# Altium schematic sheet TEMPLATE_Circuit.SchDoc
size Tabloid; Date: Date; Author: Author 1; Revision: 1; SheetNumber: 3; SheetTotal: 4; Size: 11x17; Sheet_Name: Circuit
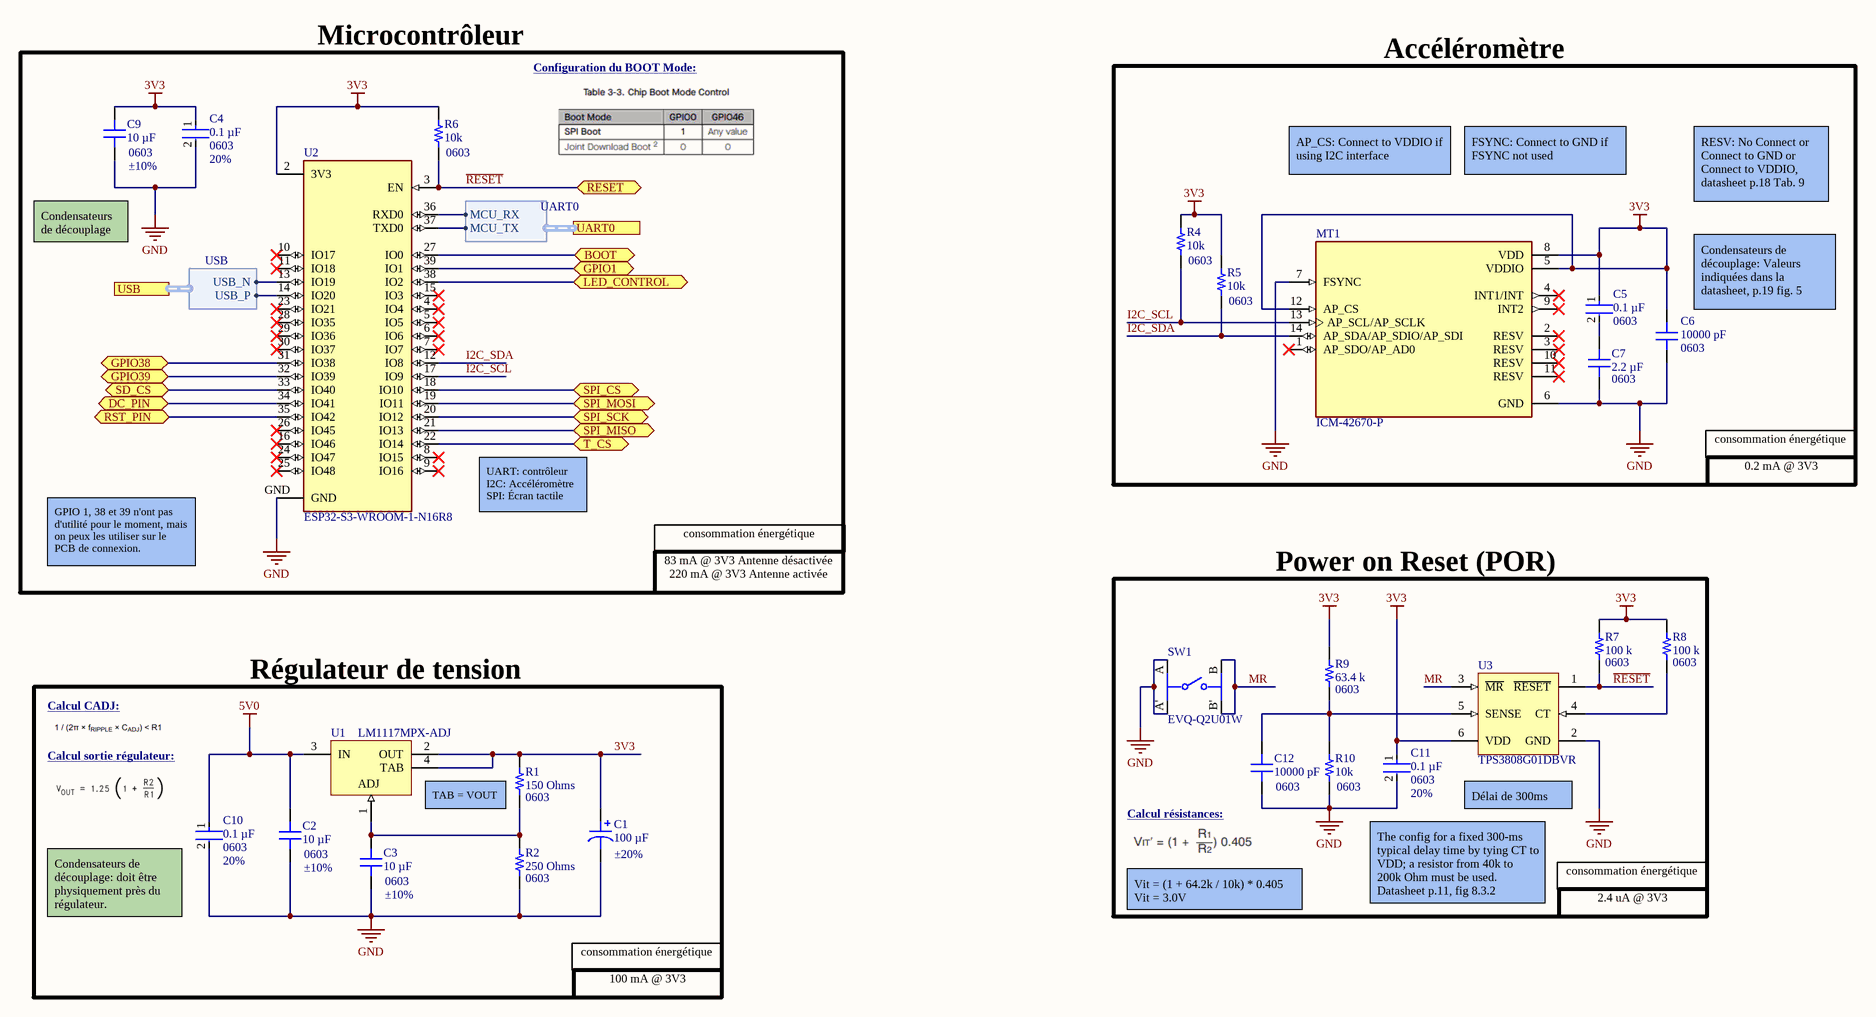
[diagram p0: TEMPLATE_Circuit.SchDoc]

## Parts
C1  100 µF  Tolerance: ±20%  [CAP ALSMD 6.6MM H6.1MM]
C2  Device Package: 0603  Tolerance: ±10%  [CAP 0603_1608]  (hidden comment: 10 µF)
C3  Device Package: 0603  Tolerance: ±10%  [CAP 0603_1608]  (hidden comment: 10 µF)
C4  Case Code (Imperial): 0603  Tolerance: 20%  Capacitance: 0.1 µF  [FP-0603-L_1_6_0_15-W_0_81-IPC_B]  (hidden comment: 0603ZC104MAT2A)
C5  Case Code (Imperial): 0603  Capacitance: 0.1 µF  [FP-0603-L_1_6_0_15-W_0_81-IPC_B]  (hidden comment: 0603ZC104MAT2A)
C6  Package / Case: 0603  [CAP 0603_1608]  (hidden comment: 10000 pF)
C7  Package / Case: 0603  [MURATA GRM188 0603_1608]  (hidden comment: 2.2 µF)
C9  Device Package: 0603  Tolerance: ±10%  [CAP 0603_1608]  (hidden comment: 10 µF)
C10  Case Code (Imperial): 0603  Tolerance: 20%  Capacitance: 0.1 µF  [FP-0603-L_1_6_0_15-W_0_81-IPC_B]  (hidden comment: 0603ZC104MAT2A)
C11  Case Code (Imperial): 0603  Tolerance: 20%  Capacitance: 0.1 µF  [FP-0603-L_1_6_0_15-W_0_81-IPC_B]  (hidden comment: 0603ZC104MAT2A)
C12  Device Package: 0603  [CAP 0603_1608]  (hidden comment: 10000 pF)
MT1  ICM-42670-P  [XDCR_ICM-42670-P]
R1  Supplier Device Package: 0603  [RES 0603_1608]  (hidden comment: 150 Ohms)
R2  Supplier Device Package: 0603  [RES 0603_1608]  (hidden comment: 250 Ohms)
R4  Supplier Device Package: 0603  [RES 0603_1608]  (hidden comment: 10k)
R5  Supplier Device Package: 0603  [RES 0603_1608]  (hidden comment: 10k)
R6  Supplier Device Package: 0603  [RES 0603_1608]  (hidden comment: 10k)
R7  Supplier Device Package: 0603  [RES 0603_1608]  (hidden comment: 100 k)
R8  Supplier Device Package: 0603  [RES 0603_1608]  (hidden comment: 100 k)
R9  Package / Case: 0603  [YAGEO RES 0603_1608]  (hidden comment: 63.4 k)
R10  Supplier Device Package: 0603  [RES 0603_1608]  (hidden comment: 10k)
SW1  EVQ-Q2U01W  [FP-EVQ-Q2U01W-MFG]
U1  LM1117MPX-ADJ  [MP04A_N]
U2  ESP32-S3-WROOM-1-N16R8  [XCVR_ESP32-S3-WROOM-1-N16R2]
U3  TPS3808G01DBVR  [DBV0006A_L]

## Blocks framed on the sheet
Microcontrôleur: C4 C9 R6 U2
Accéléromètre: C5-C7 MT1 R4 R5
Power on Reset (POR): C11 C12 R7-R10 SW1 U3
Régulateur de tension: C1-C3 C10 R1 R2 U1

## Ports
BOOT (bidir), DC_PIN (bidir), GPIO1 (bidir), GPIO38 (bidir), GPIO39 (bidir), LED_CONTROL (bidir), RESET (bidir), RST_PIN (bidir), SD_CS (bidir), SPI_CS (bidir), SPI_MISO (bidir), SPI_MOSI (bidir), SPI_SCK (bidir), T_CS (bidir), UART0 (harness UART0), USB (harness USB)

## Harnesses
UART0: MCU_RX, MCU_TX
USB: USB_N, USB_P

## Nets
3V3: C1.1 C4.1 C5.1 C6.2 C9.2 C11.1 MT1.5(VDDIO) MT1.8(VDD) MT1.12(AP_CS) R1.2 R4.2 R5.2 R6.2 R7.2 R8.2 R9.2 U1.2(OUT) U1.4(TAB) U2.2(3V3) U3.6(VDD)
5V0: C2.2 C10.1 U1.3(IN)
GND: C1.2 C2.1 C3.1 C4.2 C6.1 C7.1 C9.1 C10.2 C11.2 C12.1 MT1.6(GND) MT1.7(FSYNC) R2.1 R10.1 SW1.A SW1.A' U2.GND U3.2(GND)
~{RESET}: R6.1 R7.1 U2.3(EN) U3.1(~{RESET}) ; port RESET
BOOT: U2.27(IO0) ; port BOOT
DC_PIN: U2.34(IO41) ; port DC_PIN
GPIO1: U2.39(IO1) ; port GPIO1
GPIO38: U2.31(IO38) ; port GPIO38
GPIO39: U2.32(IO39) ; port GPIO39
I2C_SCL: MT1.13(AP_SCL/AP_SCLK) R4.1 U2.17(IO9)
I2C_SDA: MT1.14(AP_SDA/AP_SDIO/AP_SDI) R5.1 U2.12(IO8)
LED_CONTROL: U2.38(IO2) ; port LED_CONTROL
MR: SW1.B SW1.B' U3.3(~{MR})
RST_PIN: U2.35(IO42) ; port RST_PIN
SD_CS: U2.33(IO40) ; port SD_CS
SPI_CS: U2.18(IO10) ; port SPI_CS
SPI_MISO: U2.21(IO13) ; port SPI_MISO
SPI_MOSI: U2.19(IO11) ; port SPI_MOSI
SPI_SCK: U2.20(IO12) ; port SPI_SCK
T_CS: U2.22(IO14) ; port T_CS
NetC3_2: C3.2 R1.1 R2.2 U1.1(ADJ)
NetC5_2: C5.2 C7.2
NetC12_2: C12.2 R9.1 R10.2 U3.5(SENSE)
NetR8_1: R8.1 U3.4(CT)
NetU2_13: U2.13(IO19) ; port USB.USB_N
NetU2_14: U2.14(IO20) ; port USB.USB_P
NetU2_36: U2.36(RXD0) ; port UART0.MCU_RX
NetU2_37: U2.37(TXD0) ; port UART0.MCU_TX

Not connected (* = marked no-connect by the designer): MT1 1(AP_SDO/AP_AD0)* 2(RESV)* 3(RESV)* 4(INT1/INT)* 9(INT2)* 10(RESV)* 11(RESV)*; U2 4(IO4)* 5(IO5)* 6(IO6)* 7(IO7)* 8(IO15)* 9(IO16)* 10(IO17)* 11(IO18)* 15(IO3)* 16(IO46)* 23(IO21)* 24(IO47)* 25(IO48)* 26(IO45)* 28(IO35)* 29(IO36)* 30(IO37)*

## Notes on the sheet
- Configuration du BOOT Mode:
- AP_CS: Connect to VDDIO if using I2C interface
- FSYNC: Connect to GND if FSYNC not used
- RESV: No Connect or Connect to GND or Connect to VDDIO, datasheet p.18 Tab. 9
- Condensateurs de découplage
- (near C6) Condensateurs de découplage: Valeurs indiquées dans la datasheet, p.19 fig. 5
- consommation énergétique
- 0.2 mA @ 3V3
- GPIO 1, 38 et 39 n'ont pas d'utilité pour le moment, mais on peux les utiliser sur le PCB de connexion.
- UART: contrôleur I2C: Accéléromètre SPI: Écran tactile
- 83 mA @ 3V3 Antenne désactivée 220 mA @ 3V3 Antenne activée
- Calcul sortie régulateur:
- Calcul CADJ:
- TAB = VOUT
- (near C12) Calcul résistances:
- (near U3) Délai de 300ms
- Vit = (1 + 64.2k / 10k) * 0.405 Vit = 3.0V
- The config for a fixed 300-ms typical delay time by tying CT to VDD; a resistor from 40k to 200k Ohm must be used. Datasheet p.11, fig 8.3.2
- (near C10) Condensateurs de découplage: doit être physiquement près du régulateur.
- 2.4 uA @ 3V3
- 100 mA @ 3V3
- Nom de la feuille
- Titre du projet
- Cours associé au projet
- Taille
- Département
- Technologies du
- Révision
- PCB
- .
- SCH
- Date
- génie électrique
- Feuille
- Variant
- de
- Concepteurs

## Library data of the parts
C1 = 10SGV100M6.3X6.1: CAP ALUM 100UF 20% 10V SMD; manufacturer: Rubycon; Lifetime @ Temp.: 2000 Hrs @ 105°C; Polarization: Polar; Ripple Current @ High Frequency: 85.2 mA @ 10 kHz; Ripple Current @ Low Frequency: 71 mA @ 120 Hz; Surface Mount Land Size: 0.260" L x 0.260" W (6.60mm x 6.60mm); Part Number: 10SGV100M6.3X6.1; Applications: Automotive; Capacitance: 100 µF; componentlink1description: Datasheet; componentlink1url: http://www.rubycon.co.jp/en/catalog/e_pdfs/aluminum/e_sgv.pdf; componentlink2description: DigiKey Link; componentlink2url: https://www.digikey.com/en/products/detail/rubycon/10SGV100M6-3X6-1/3568604; Device Package: Radial, Can - SMD; Height - Seated (Max): 0.240" (6.10mm); lastupdated: 6/3/2024 8:16:10 PM; Lifecycle Status: Active; Minimum Order: 1; Mounting Type: Surface Mount; Operating Temperature: -55°C ~ 105°C; Package / Case: Radial, Can - SMD; packaging: TapeAndReel; partid: 8082; Part Status: Active; price: 0.08; Ratings: AEC-Q200; series: SGV; Size / Dimension: 0.248" Dia (6.30mm); Supplier 1: DigiKey; Supplier Part Number 1: 1189-2392-1-ND; value: 100 µF; Voltage - Rated: 10 V
C2 C3 C9 = GRT188R61A106KE13D: CAP CER 10UF 10V X5R 0603; manufacturer: Murata Electronics; Part Number: GRT188R61A106KE13D; Value: 10 µF; Applications: Automotive; Capacitance: 10 µF; componentlink1description: Datasheet; componentlink1url: https://search.murata.co.jp/Ceramy/image/img/A01X/G101/ENG/GRT188R61A106KE13-01.pdf; componentlink2description: DigiKey Link; componentlink2url: https://www.digikey.com/en/products/detail/murata-electronics/GRT188R61A106KE13D/5416733; Features: Derating Recommended; lastupdated: 2/9/2024 8:10:30 PM; Lifecycle Status: Active; Minimum Order: 1; Mounting Type: Surface Mount, MLCC; Operating Temperature: -55°C ~ 85°C; Package / Case: 0603 (1608 Metric); packaging: TapeAndReel; partid: 2522; Part Status: Active; price: 0.06; Ratings: AEC-Q200; series: GRT; Size / Dimension: 0.063" L x 0.031" W (1.60mm x 0.80mm); Supplier 1: DigiKey; Supplier Part Number 1: 490-12311-1-ND; Temperature Coefficient: X5R; Thickness (Max): 0.037" (0.95mm); Voltage - Rated: 10V
C4 C5 C10 C11 = CMP-2006-04550-2: General Purpose Ceramic Capacitor, 0603, 100nF, 20%, X7R, 15%, 10V; Mount: Surface Mount; Package Quantity: 4000; RoHS Compliant: Yes; Voltage Rating: 10V; Packaging: Tape and Reel; Series: -; Thickness: 0.035inch; Number of Pins: 2; Min Operating Temperature: -55°C; Case/Package: 0603; Length: 1.6mm; Radiation Hardening: No; Voltage Rating (DC): 10V; Depth: 0.81mm; Lead Pitch: 0.014inch; Termination: SMD/SMT; Case Code (Metric): 1608; Construction: Flat; Width: 0.032inch; Lead Free: Lead Free; Max Operating Temperature: 125°C; Dielectric: X7R
  C5: Tolerance: 20%
C6 = C0603C103K4RECAUTO: CAP CER 0603 10NF 16V X7R 10%; manufacturer: KEMET; Part Number: C0603C103K4RECAUTO; Value: 10000 pF; Applications: Automotive, ESD Protection; Capacitance: 10000 pF; componentlink1description: Datasheet; componentlink1url: https://api.kemet.com/component-edge/download/datasheet/C0603C103K4RECAUTO.pdf; componentlink2description: DigiKey Link; componentlink2url: https://www.digikey.com/en/products/detail/kemet/C0603C103K4RECAUTO/8640474; Device Package: 0603 (1608 Metric); lastupdated: 2/9/2024 8:10:22 PM; Lifecycle Status: Active; Minimum Order: 1; Mounting Type: Surface Mount, MLCC; Operating Temperature: -55°C ~ 125°C; packaging: TapeAndReel; partid: 8251; Part Status: Active; price: 0.01; Ratings: AEC-Q200; series: ESD SMD Auto X7R; Size / Dimension: 0.063" L x 0.031" W (1.60mm x 0.80mm); Supplier 1: DigiKey; Supplier Part Number 1: 399-17880-1-ND; Temperature Coefficient: X7R; Thickness (Max): 0.034" (0.87mm); Tolerance: ±10%; Voltage - Rated: 16V
C7 = GRM188R61E225KA12D: CAP CER 2.2UF 25V X5R 0603; manufacturer: Murata Electronics; Tolerance: ±10%; Part Number: GRM188R61E225KA12D; Value: 2.2 µF; Applications: General Purpose; Capacitance: 2.2 µF; componentlink1description: Datasheet; componentlink1url: https://search.murata.co.jp/Ceramy/image/img/A01X/G101/ENG/GRM188R61E225KA12-01.pdf; componentlink2description: DigiKey Link; componentlink2url: https://www.digikey.com/en/products/detail/murata-electronics/GRM188R61E225KA12D/4905349; Device Package: 0603 (1608 Metric); lastupdated: 7/20/2024 12:23:22 AM; Lifecycle Status: Active; Minimum Order: 1; Mounting Type: Surface Mount, MLCC; Operating Temperature: -55°C ~ 85°C; packaging: TapeAndReel; partid: 2326; Part Status: Active; price: 0.01; series: GRM; Size / Dimension: 0.063" L x 0.031" W (1.60mm x 0.80mm); Supplier 1: DigiKey; Supplier Part Number 1: 490-10731-1-ND; Temperature Coefficient: X5R; Thickness (Max): 0.035" (0.90mm); Voltage - Rated: 25V
C12 = AC0603KRX7R0BB103: CAP CER 10000PF 100V X7R 0603; manufacturer: Yageo; Tolerance: ±10%; Part Number: AC0603KRX7R0BB103; Value: 10000 pF; Applications: Automotive; Capacitance: 10000 pF; componentlink1description: Datasheet; componentlink1url: http://www.yageo.com/NewPortal/_en/search/productDocs.jsp?YageoPartNumber=AC0603KRX7R0BB103; componentlink2description: DigiKey Link; componentlink2url: https://www.digikey.com/en/products/detail/yageo/AC0603KRX7R0BB103/6643086; lastupdated: 2024-02-09 20:10:30; Lifecycle Status: Active; Minimum Order: 1; Mounting Type: Surface Mount, MLCC; Operating Temperature: -55°C ~ 125°C; Package / Case: 0603 (1608 Metric); packaging: TapeAndReel; partid: 2218; Part Status: Active; price: 0.01; Ratings: AEC-Q200; series: AC; Size / Dimension: 0.063" L x 0.031" W (1.60mm x 0.80mm); Supplier 1: DigiKey; Supplier Part Number 1: 311-3100-1-ND; Temperature Coefficient: X7R; Thickness (Max): 0.035" (0.90mm); Voltage - Rated: 100V
R1 = RMCF0603FT150R: RES 150 OHM 1% 1/10W 0603; Manufacturer: Stackpole Electronics Inc; Power (Watts): 0.1W, 1/10W; Temperature Coefficient: ±100ppm/°C; Part Number: RMCF0603FT150R; Value: 150 Ohms; ComponentLink1Description: Datasheet; ComponentLink1URL: https://www.seielect.com/catalog/sei-rmcf_rmcp.pdf; ComponentLink2Description: DigiKey Link; ComponentLink2URL: https://www.digikey.com/en/products/detail/stackpole-electronics-inc/RMCF0603FT150R/1761314; Composition: Thick Film; Device Package: 0603 (1608 Metric); Features: Automotive AEC-Q200; Height - Seated (Max): 0.022" (0.55mm); LastUpdated: 2/9/2024 8:43:14 PM; Lifecycle Status: Active; Minimum Order: 1; Number of Terminations: 2; Operating Temperature: -55°C ~ 155°C; Package / Case: 0603 (1608 Metric); Packaging: CutTape; PartId: 10675; Part Status: Active; Price: 0.01; Ratings: AEC-Q200; Resistance: 150 Ohms; Series: RMCF; Size / Dimension: 0.061" L x 0.031" W (1.55mm x 0.80mm); Supplier 1: DigiKey; Supplier Part Number 1: RMCF0603FT150RCT-ND; Tolerance: ±1%
R2 = CH0603-250RJNTA: RES 250 OHM 5% 1/8W 0603; Manufacturer: Vishay Sfernice; Power (Watts): 0.125W, 1/8W; Temperature Coefficient: ±100ppm/°C; Part Number: CH0603-250RJNTA; Value: 250 Ohms; ComponentLink1Description: Datasheet; ComponentLink1URL: http://www.vishay.com/docs/53014/ch.pdf; ComponentLink2Description: DigiKey Link; ComponentLink2URL: https://www.digikey.com/en/products/detail/vishay-sfernice/CH0603-250RJNTA/9405751; Composition: Thin Film; Device Package: 0603 (1608 Metric); Features: RF, High Frequency; Height - Seated (Max): 0.025" (0.63mm); LastUpdated: 2/9/2024 8:43:16 PM; Lifecycle Status: Active; Minimum Order: 1; Number of Terminations: 2; Operating Temperature: -55°C ~ 155°C; Package / Case: 0603 (1608 Metric); Packaging: TapeAndReel; PartId: 10119; Part Status: Active; Price: 2.39; Resistance: 250 Ohms; Series: CH; Size / Dimension: 0.060" L x 0.030" W (1.52mm x 0.76mm); Supplier 1: DigiKey; Supplier Part Number 1: 716-1168-1-ND; Tolerance: ±5%
R4-R6 R10 = RNCS0603BKE10K0: RES 10K OHM 0.1% 1/16W 0603; Manufacturer: Stackpole Electronics Inc; Power (Watts): 0.063W, 1/16W; Resistance: 10 kOhms; Temperature Coefficient: ±25ppm/°C; Part Number: RNCS0603BKE10K0; Value: 10k; ComponentLink1Description: Datasheet; ComponentLink1URL: https://www.seielect.com/catalog/sei-rncs_rnch.pdf; ComponentLink2Description: DigiKey Link; ComponentLink2URL: https://www.digikey.com/en/products/detail/stackpole-electronics-inc/RNCS0603BKE10K0/1708836; Composition: Thin Film; Device Package: 0603 (1608 Metric); Features: Anti-Corrosive, Automotive AEC-Q200, Moisture Resistant; Height - Seated (Max): 0.022" (0.55mm); LastUpdated: 2/9/2024 8:43:37 PM; Lifecycle Status: Active; Minimum Order: 1; Number of Terminations: 2; Operating Temperature: -55°C ~ 155°C; Package / Case: 0603 (1608 Metric); Packaging: TapeAndReel; PartId: 4838; Part Status: Active; Price: 0.06; Ratings: AEC-Q200; Series: RNCS; Size / Dimension: 0.061" L x 0.031" W (1.55mm x 0.80mm); Supplier 1: DigiKey; Supplier Part Number 1: RNCS0603BKE10K0CT-ND; Tolerance: ±0.1%
R7 R8 = RCS0603100KFKEA: RES SMD 100K OHM 1% 1/4W 0603; Manufacturer: Vishay Dale; Power (Watts): 0.25W, 1/4W; Resistance: 100 kOhms; Temperature Coefficient: ±100ppm/°C; Part Number: RCS0603100KFKEA; Value: 100 k; ComponentLink1Description: Datasheet; ComponentLink1URL: http://www.vishay.com/docs/20065/rcse3.pdf; ComponentLink2Description: DigiKey Link; ComponentLink2URL: https://www.digikey.com/en/products/detail/vishay-dale/RCS0603100KFKEA/5866946; Composition: Thick Film; Device Package: 0603 (1608 Metric); Features: Automotive AEC-Q200, Pulse Withstanding; Height - Seated (Max): 0.020" (0.50mm); LastUpdated: 2/9/2024 8:43:35 PM; Lifecycle Status: Active; Minimum Order: 1; Number of Terminations: 2; Operating Temperature: -55°C ~ 155°C; Package / Case: 0603 (1608 Metric); Packaging: TapeAndReel; PartId: 5363; Part Status: Active; Price: 0.01; Ratings: AEC-Q200; Series: RCS e3; Size / Dimension: 0.061" L x 0.033" W (1.55mm x 0.85mm); Supplier 1: DigiKey; Supplier Part Number 1: 541-2800-1-ND; Tolerance: ±1%
R9 = RC0603FR-0763K4L: RES 63.4K OHM 1% 1/10W 0603; Manufacturer: Yageo; Power (Watts): 0.1W, 1/10W; Resistance: 63.4 kOhms; Temperature Coefficient: ±100ppm/°C; Part Number: RC0603FR-0763K4L; Value: 63.4 k; ComponentLink1Description: Datasheet; ComponentLink1URL: https://www.yageo.com/upload/media/product/productsearch/datasheet/rchip/PYu-RC_Group_51_RoHS_L_10.pdf; ComponentLink2Description: DigiKey Link; ComponentLink2URL: https://www.digikey.com/en/products/detail/yageo/RC0603FR-0763K4L/727340; Composition: Thick Film; Device Package: 0603 (1608 Metric); Features: Moisture Resistant; Height - Seated (Max): 0.022" (0.55mm); LastUpdated: 7/25/2024 9:19:31 AM; Lifecycle Status: Active; Minimum Order: 1; Number of Terminations: 2; Operating Temperature: -55°C ~ 155°C; Packaging: CutTape; PartId: 7647; Part Status: Active; Price: 0.01; Series: RC_L; Size / Dimension: 0.063" L x 0.031" W (1.60mm x 0.80mm); Supplier 1: DigiKey; Supplier Part Number 1: 311-63.4KHRCT-ND; Tolerance: ±1%
SW1 = CMP-05618-000050-1: SWITCH TACTILE SPST-NO 0.02A 15V; Mechanical Life: 200000Cycles; Actuator Color: White; Contact Resistance: 100mR; Throw Configuration: SPST; Voltage Rating (AC): 250V; Actuator Length: 0.2mm; Current Rating: 20mA; Switch Travel: 0.25mm; Illumination Type: Non-Illuminated; Actuator Type: Standard; Operating Force: 2.6N; Switch Function: Off-Mom; Packaging: Tape and Reel; Min Operating Temperature: -40°C; Contact Plating: Silver; Max Operating Temperature: 85°C; Max Voltage Rating (DC): 15V; Size: 1.8mm; Mount: Surface Mount; RoHS Compliant: Yes; Orientation: Straight; Electrical Life: 200000Cycles; Lead Free: Lead Free; Case/Package: SMD/SMT; Contact Current Rating: 20mA; Voltage Rating (DC): 15V; Series: EVQQ2; Color: White; Radiation Hardening: No; Termination: SMD/SMT; Package Quantity: 1; Thickness: 1.8mm
U1 = CMP-0062-01642-3: 800mA Low-Dropout Linear Regulator, 4-pin SOT-223; Manufacturer: National Semiconductor; CompType: LDO IC; PowerWise: N; PackageTopMarking: XYTT*N03A; High-Reliability: Y; DatasheetVersion: Apr-2006; PackageReference: MP04A; Code_JEDEC: TO-261-AA; ComponentLink2URL: http://www.national.com/ds/LM/LM1117.pdf; ComponentLink3Description: LM1117 Web Page; ComponentLink4Description: MP04A Package Page; ComponentLink2Description: LM1117 Datasheet; PinCount: 4; Code_IPC: SOT223-4; PartNumber: LM1117MPX-ADJ; ComponentLink1Description: Manufacturer URL; ComponentLink3URL: http://www.national.com/pf/LM/LM1117.html; ComponentLink4URL: http://www.national.com/packaging/folders/mp04a.html; RoHS: N; PackageDescription: Molded SOT-223, 6.50 x 3.56 x 1.6mm Body, 4 Lead, 2.3mm Pitch; RevisionNote: SCH symbol layout adjusted; ComponentLink1URL: http://www.national.com/; PackageVersion: revB, Apr-2003
U2 = CMP-005-000018-2: Bluetooth, WiFi 802.11b/g/n, Bluetooth v5.0 Transceiver Module 2.4GHz PCB Trace Surface Mount; MF: Espressif Systems; MP: ESP32S3WROOM1N16R2; SnapEDA_Link: https://www.snapeda.com/parts/ESP32S3WROOM1N16R2/Espressif+Systems/view-part/?ref=snap; Component Type: Standard; Source: ESP32-S3-WROOM-1-N16R2.SchLib; Value: *; Package: NON STANDARD Espressif Systems; Pin Count: 39; Check_prices: https://www.snapeda.com/parts/ESP32S3WROOM1N16R2/Espressif+Systems/view-part/?ref=eda; Design Item ID: ESP32-S3-WROOM-1-N16R2
U3 = CMP-0332-00558-2: Low Quiescent Current, Programmable-Delay Supervisory Circuit, 1 Supply Monitored, -40 to 125 degC, 6-pin SOT-23 (DBV), Green (RoHS & no Sb/Br); Manufacturer: Texas Instruments; Rating: Catalog; SubFamily: Supervisor and Reset IC; Iq(Typ)(uA): 2.4; Output Driver Type / Reset Output: Active-low, Open-drain; Threshold Voltage 1 (typ)(Typ)(V): Adjustable; VCC(Max)(V): 6.5; VCC(Min)(V): 1.7; Reset Threshold Accuracy(%): 1; Code_JEDEC: MO-178-AB*; Mounting Technology: Surface Mount; DatasheetVersion: SBVS050J; Time Delay(ms): Programmable; ComponentLink1URL: http://www.ti.com/general/docs/lit/getliterature.tsp?genericPartNumber=TPS3808G01&fileType=pdf; PartNumber: TPS3808G01DBVR; PackageVersion: revK, Mar-2006; PackageReference: DBV0006A; # of Supplies Monitored: 1; ComponentLink1Description: Datasheet; PackageDescription: 6-Pin Plastic Small-Outline Package, 2.9 x 1.6 mm Body, 0.95 mm Pitch, 2.8 mm Lead Span
MT1 = ICM-42670-P: Package: None; Price: None; Value: *; MP: ICM-42670-P; Availability: Unavailable